# EAGLE design MEB-Quectel-BG96-v1.1.0 (EAGLE 9.3.1)

## Sheet 1 of 4
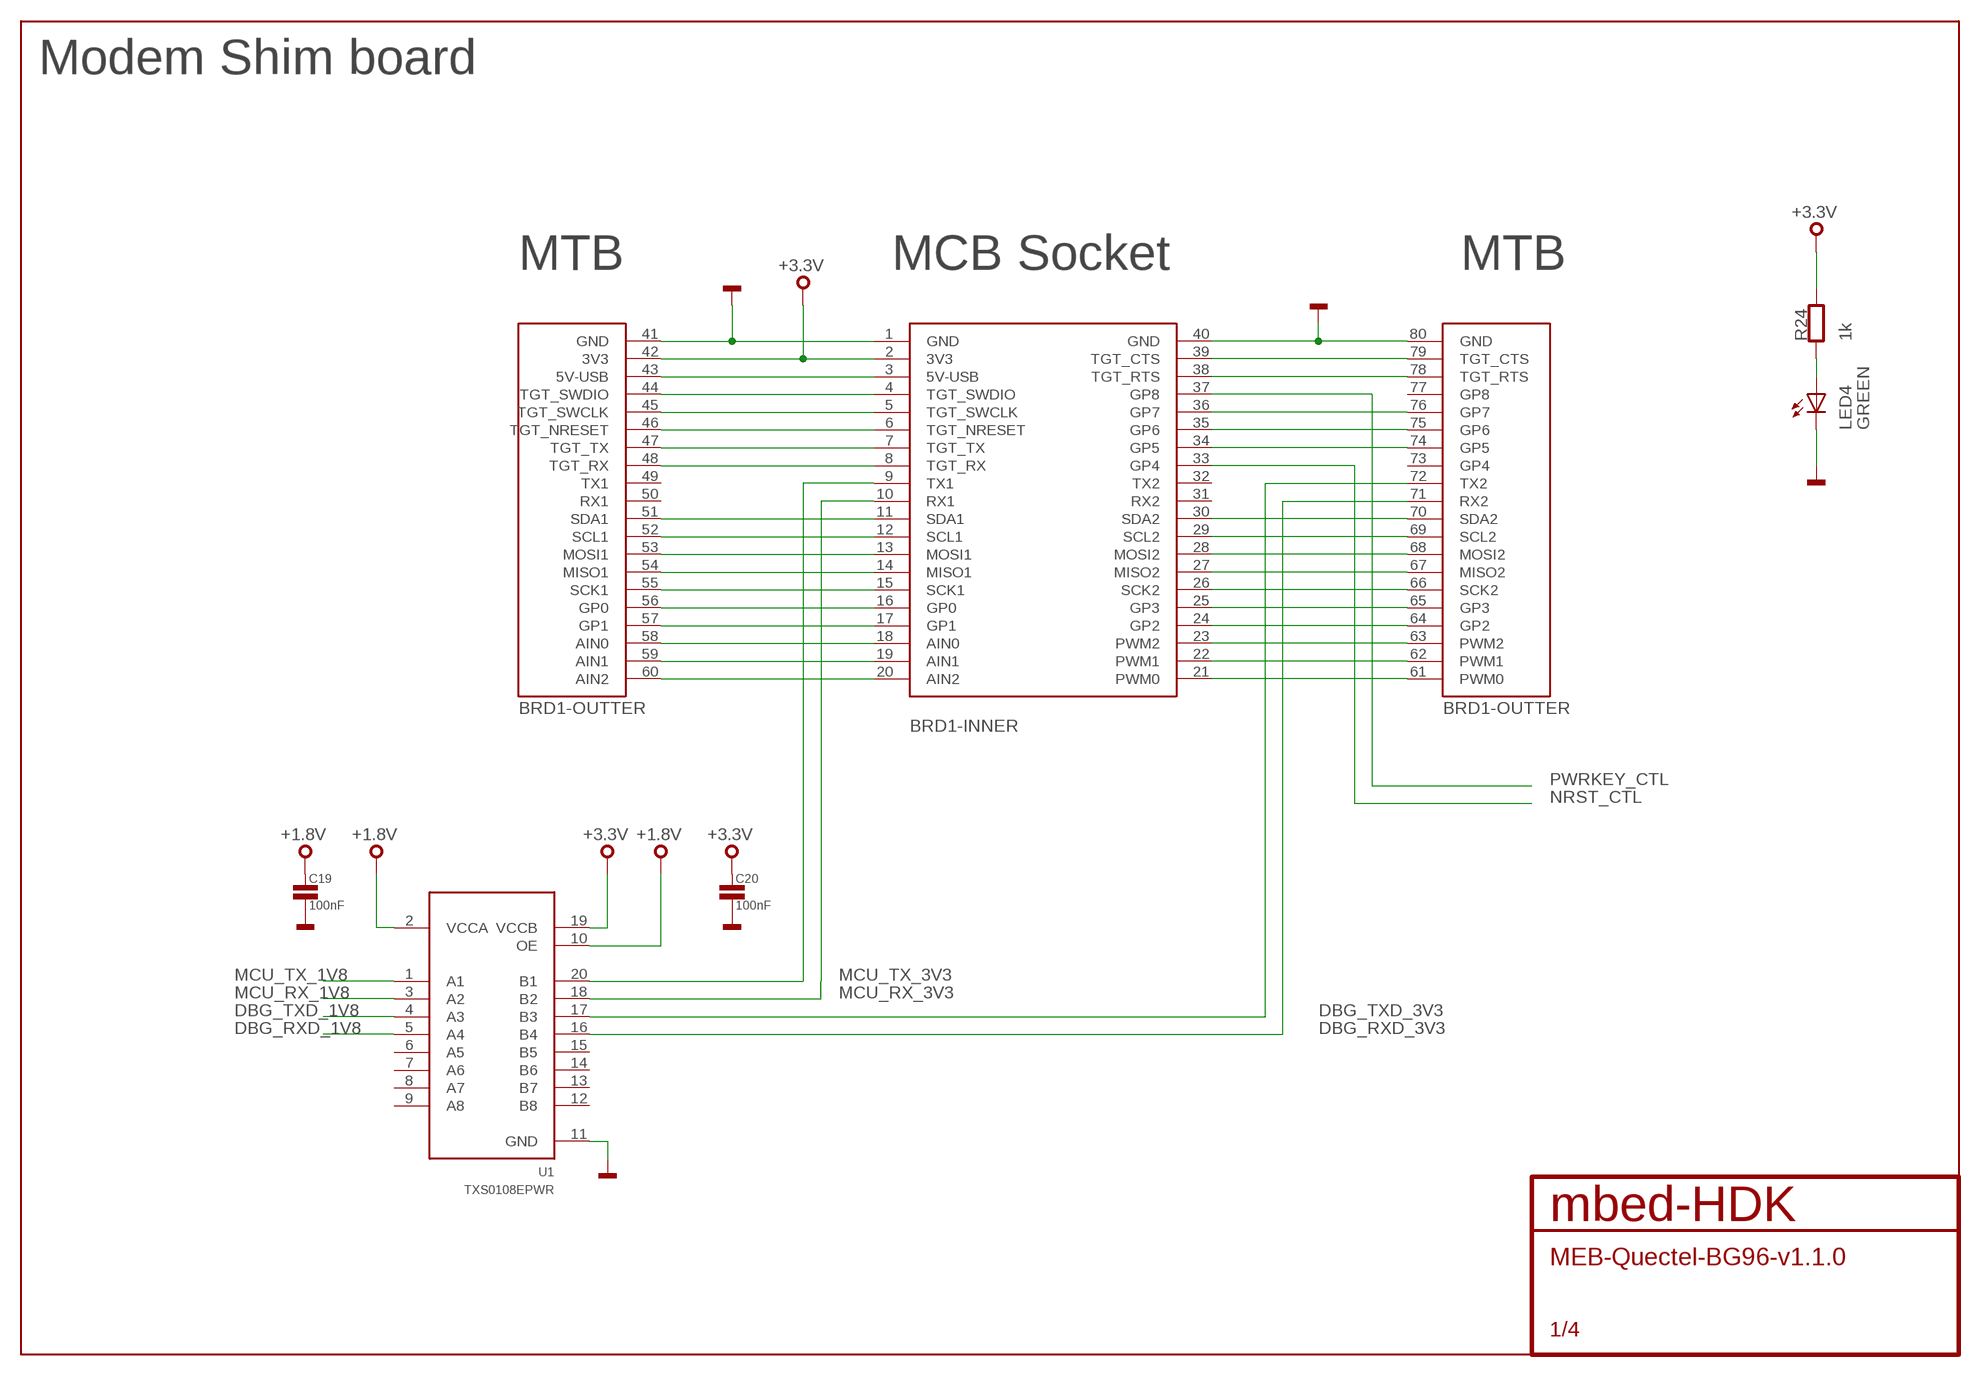
[diagram p0: schematic, sheet 1]

### Parts
BRD1  MODULE-SHIM  [MODULE_SOCKET]
C19  100nF  C0603  [0603]
C20  100nF  C0603  [0603]
LED4  GREEN  LED0603  [CHIPLED_0603]
R24  1k  R0603  [0603]
U1  TXS0108EPWR  [TSSOP-20]

### Nets
+1.8V: C19.1 U1.2(VCCA) U1.10(OE) ; also sheet 3
+3.3V: BRD1.2(-INNER:3V3) BRD1.42(-OUTTER:3V3) C20.1 R24.2 U1.19(VCCB)
DBG_RXD_1V8: U1.5(A4) ; also sheet 3
DBG_RXD_3V3: BRD1.71(-OUTTER:RX2) U1.16(B4)
DBG_TXD_1V8: U1.4(A3) ; also sheet 3
DBG_TXD_3V3: BRD1.72(-OUTTER:TX2) U1.17(B3)
GND: BRD1.1(-INNER:GND) BRD1.40(-INNER:GND) BRD1.41(-OUTTER:GND) BRD1.80(-OUTTER:GND) C19.2 C20.2 LED4.C U1.11(GND) ; also sheet 2,3,4
MCU_RX_1V8: U1.3(A2) ; also sheet 3
MCU_RX_3V3: BRD1.10(-INNER:RX1) U1.18(B2)
MCU_TX_1V8: U1.1(A1) ; also sheet 3
MCU_TX_3V3: BRD1.9(-INNER:TX1) U1.20(B1)
N$1: LED4.A R24.1
N$2: BRD1.39(-INNER:TGT_CTS) BRD1.79(-OUTTER:TGT_CTS)
N$3: BRD1.38(-INNER:TGT_RTS) BRD1.78(-OUTTER:TGT_RTS)
N$5: BRD1.36(-INNER:GP7) BRD1.76(-OUTTER:GP7)
N$6: BRD1.35(-INNER:GP6) BRD1.75(-OUTTER:GP6)
N$7: BRD1.34(-INNER:GP5) BRD1.74(-OUTTER:GP5)
N$11: BRD1.30(-INNER:SDA2) BRD1.70(-OUTTER:SDA2)
N$12: BRD1.29(-INNER:SCL2) BRD1.69(-OUTTER:SCL2)
N$13: BRD1.28(-INNER:MOSI2) BRD1.68(-OUTTER:MOSI2)
N$14: BRD1.27(-INNER:MISO2) BRD1.67(-OUTTER:MISO2)
N$15: BRD1.26(-INNER:SCK2) BRD1.66(-OUTTER:SCK2)
N$16: BRD1.25(-INNER:GP3) BRD1.65(-OUTTER:GP3)
N$17: BRD1.24(-INNER:GP2) BRD1.64(-OUTTER:GP2)
N$18: BRD1.23(-INNER:PWM2) BRD1.63(-OUTTER:PWM2)
N$19: BRD1.22(-INNER:PWM1) BRD1.62(-OUTTER:PWM1)
N$20: BRD1.21(-INNER:PWM0) BRD1.61(-OUTTER:PWM0)
N$23: BRD1.3(-INNER:5V-USB) BRD1.43(-OUTTER:5V-USB)
N$24: BRD1.4(-INNER:TGT_SWDIO) BRD1.44(-OUTTER:TGT_SWDIO)
N$25: BRD1.5(-INNER:TGT_SWCLK) BRD1.45(-OUTTER:TGT_SWCLK)
N$26: BRD1.6(-INNER:TGT_NRESET) BRD1.46(-OUTTER:TGT_NRESET)
N$27: BRD1.7(-INNER:TGT_TX) BRD1.47(-OUTTER:TGT_TX)
N$28: BRD1.8(-INNER:TGT_RX) BRD1.48(-OUTTER:TGT_RX)
N$31: BRD1.11(-INNER:SDA1) BRD1.51(-OUTTER:SDA1)
N$32: BRD1.12(-INNER:SCL1) BRD1.52(-OUTTER:SCL1)
N$33: BRD1.13(-INNER:MOSI1) BRD1.53(-OUTTER:MOSI1)
N$34: BRD1.14(-INNER:MISO1) BRD1.54(-OUTTER:MISO1)
N$35: BRD1.15(-INNER:SCK1) BRD1.55(-OUTTER:SCK1)
N$36: BRD1.16(-INNER:GP0) BRD1.56(-OUTTER:GP0)
N$37: BRD1.17(-INNER:GP1) BRD1.57(-OUTTER:GP1)
N$38: BRD1.18(-INNER:AIN0) BRD1.58(-OUTTER:AIN0)
N$39: BRD1.19(-INNER:AIN1) BRD1.59(-OUTTER:AIN1)
N$40: BRD1.20(-INNER:AIN2) BRD1.60(-OUTTER:AIN2)
NRST_CTL: BRD1.33(-INNER:GP4) ; also sheet 3
PWRKEY_CTL: BRD1.37(-INNER:GP8) ; also sheet 3
Unconnected: BRD1.31(-INNER:RX2) BRD1.32(-INNER:TX2) BRD1.49(-OUTTER:TX1) BRD1.50(-OUTTER:RX1) BRD1.73(-OUTTER:GP4) BRD1.77(-OUTTER:GP8) U1.6(A5) U1.7(A6) U1.8(A7) U1.9(A8) U1.12(B8) U1.13(B7) U1.14(B6) U1.15(B5)

### Notes on the sheet
- Modem Shim board
- MTB | MCB Socket | MTB

## Sheet 2 of 4
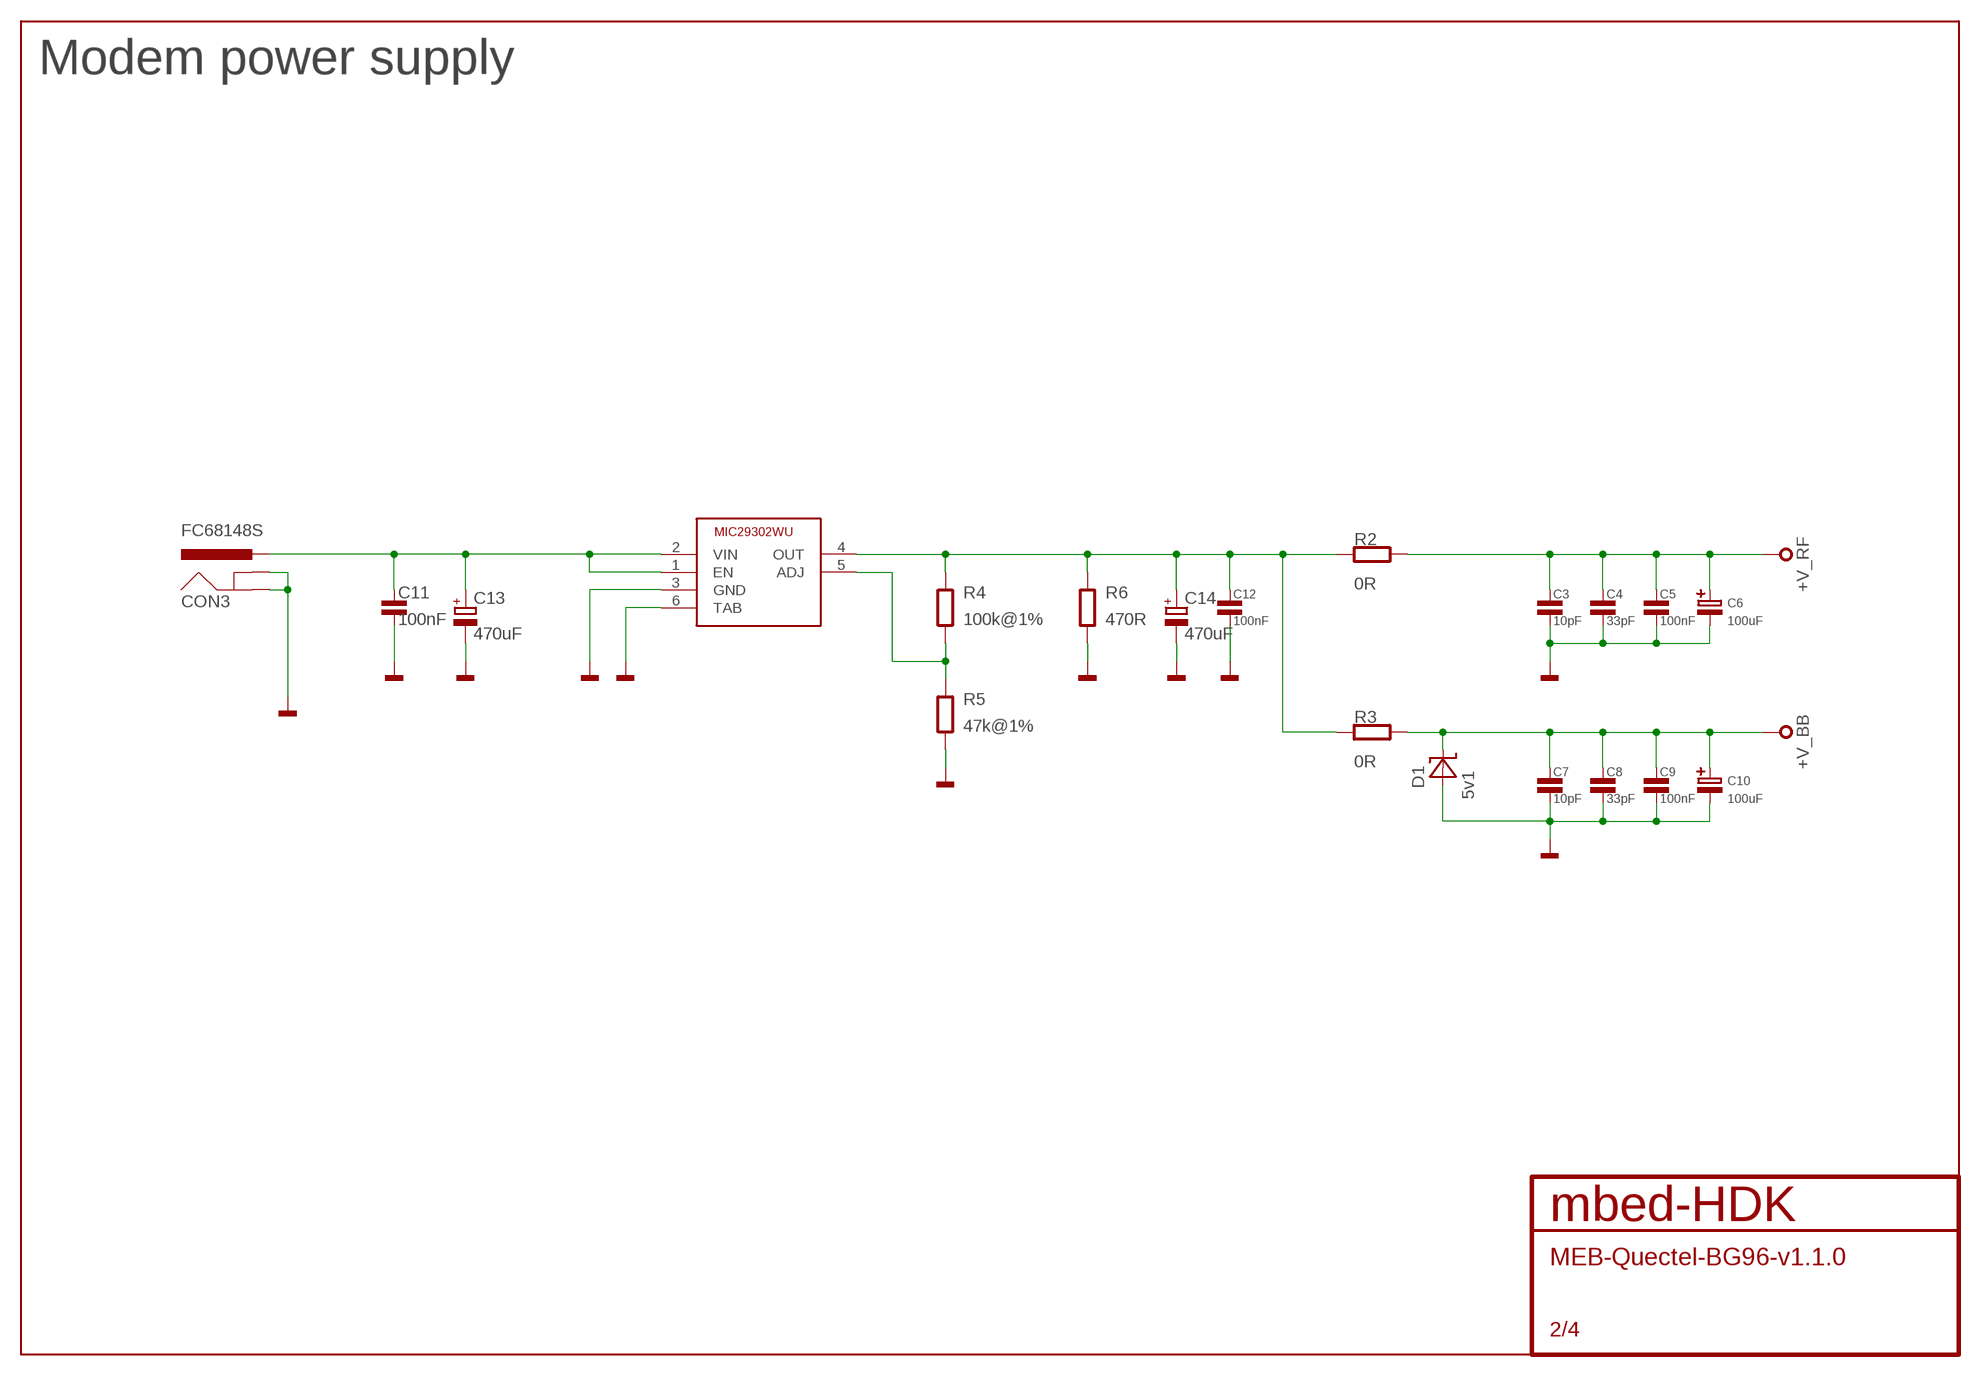
[diagram p1: schematic, sheet 2]

### Parts
C3  10pF  C0603  [0603]
C4  33pF  C0603  [0603]
C5  100nF  C0603  [0603]
C6  100uF  C-POLA  [SMC_A]
C7  10pF  C0603  [0603]
C8  33pF  C0603  [0603]
C9  100nF  C0603  [0603]
C10  100uF  C-POLA  [SMC_A]
C11  100nF  C0603  [0603]
C12  100nF  C0603  [0603]
C13  470uF  CPOL-EU150CLZ-0810  [150CLZ-0810]
C14  470uF  CPOL-EU150CLZ-0810  [150CLZ-0810]
CON3  FC68148S  [FC68148S]
D1  5v1  DIODE-ZENER  [SOD123]
IC1  MIC29302WU  [TO263-5]
R2  0R  R0603  [0603]
R3  0R  R0603  [0603]
R4  100k@1%  R0603  [0603]
R5  47k@1%  R0603  [0603]
R6  470R  R0603  [0603]

### Nets
+V_BB: C7.1 C8.1 C9.1 C10.+ D1.2(C) R3.2 ; also sheet 3
+V_RF: C3.1 C4.1 C5.1 C6.+ R2.2 ; also sheet 3
GND: C3.2 C4.2 C5.2 C6.- C7.2 C8.2 C9.2 C10.- C11.2 C12.2 C13.- C14.- CON3.2(GNDBREAK) CON3.3(GND) D1.1(A) IC1.3(GND) IC1.6(TAB) R5.1 R6.1 ; also sheet 1,3,4
N$41: C11.1 C13.+ CON3.1-1(PWR) CON3.1-2(PWR) IC1.1(EN) IC1.2(VIN)
N$42: IC1.5(ADJ) R4.1 R5.2
N$71: C12.1 C14.+ IC1.4(OUT) R2.1 R3.1 R4.2 R6.2

### Notes on the sheet
- Modem power supply

## Sheet 3 of 4
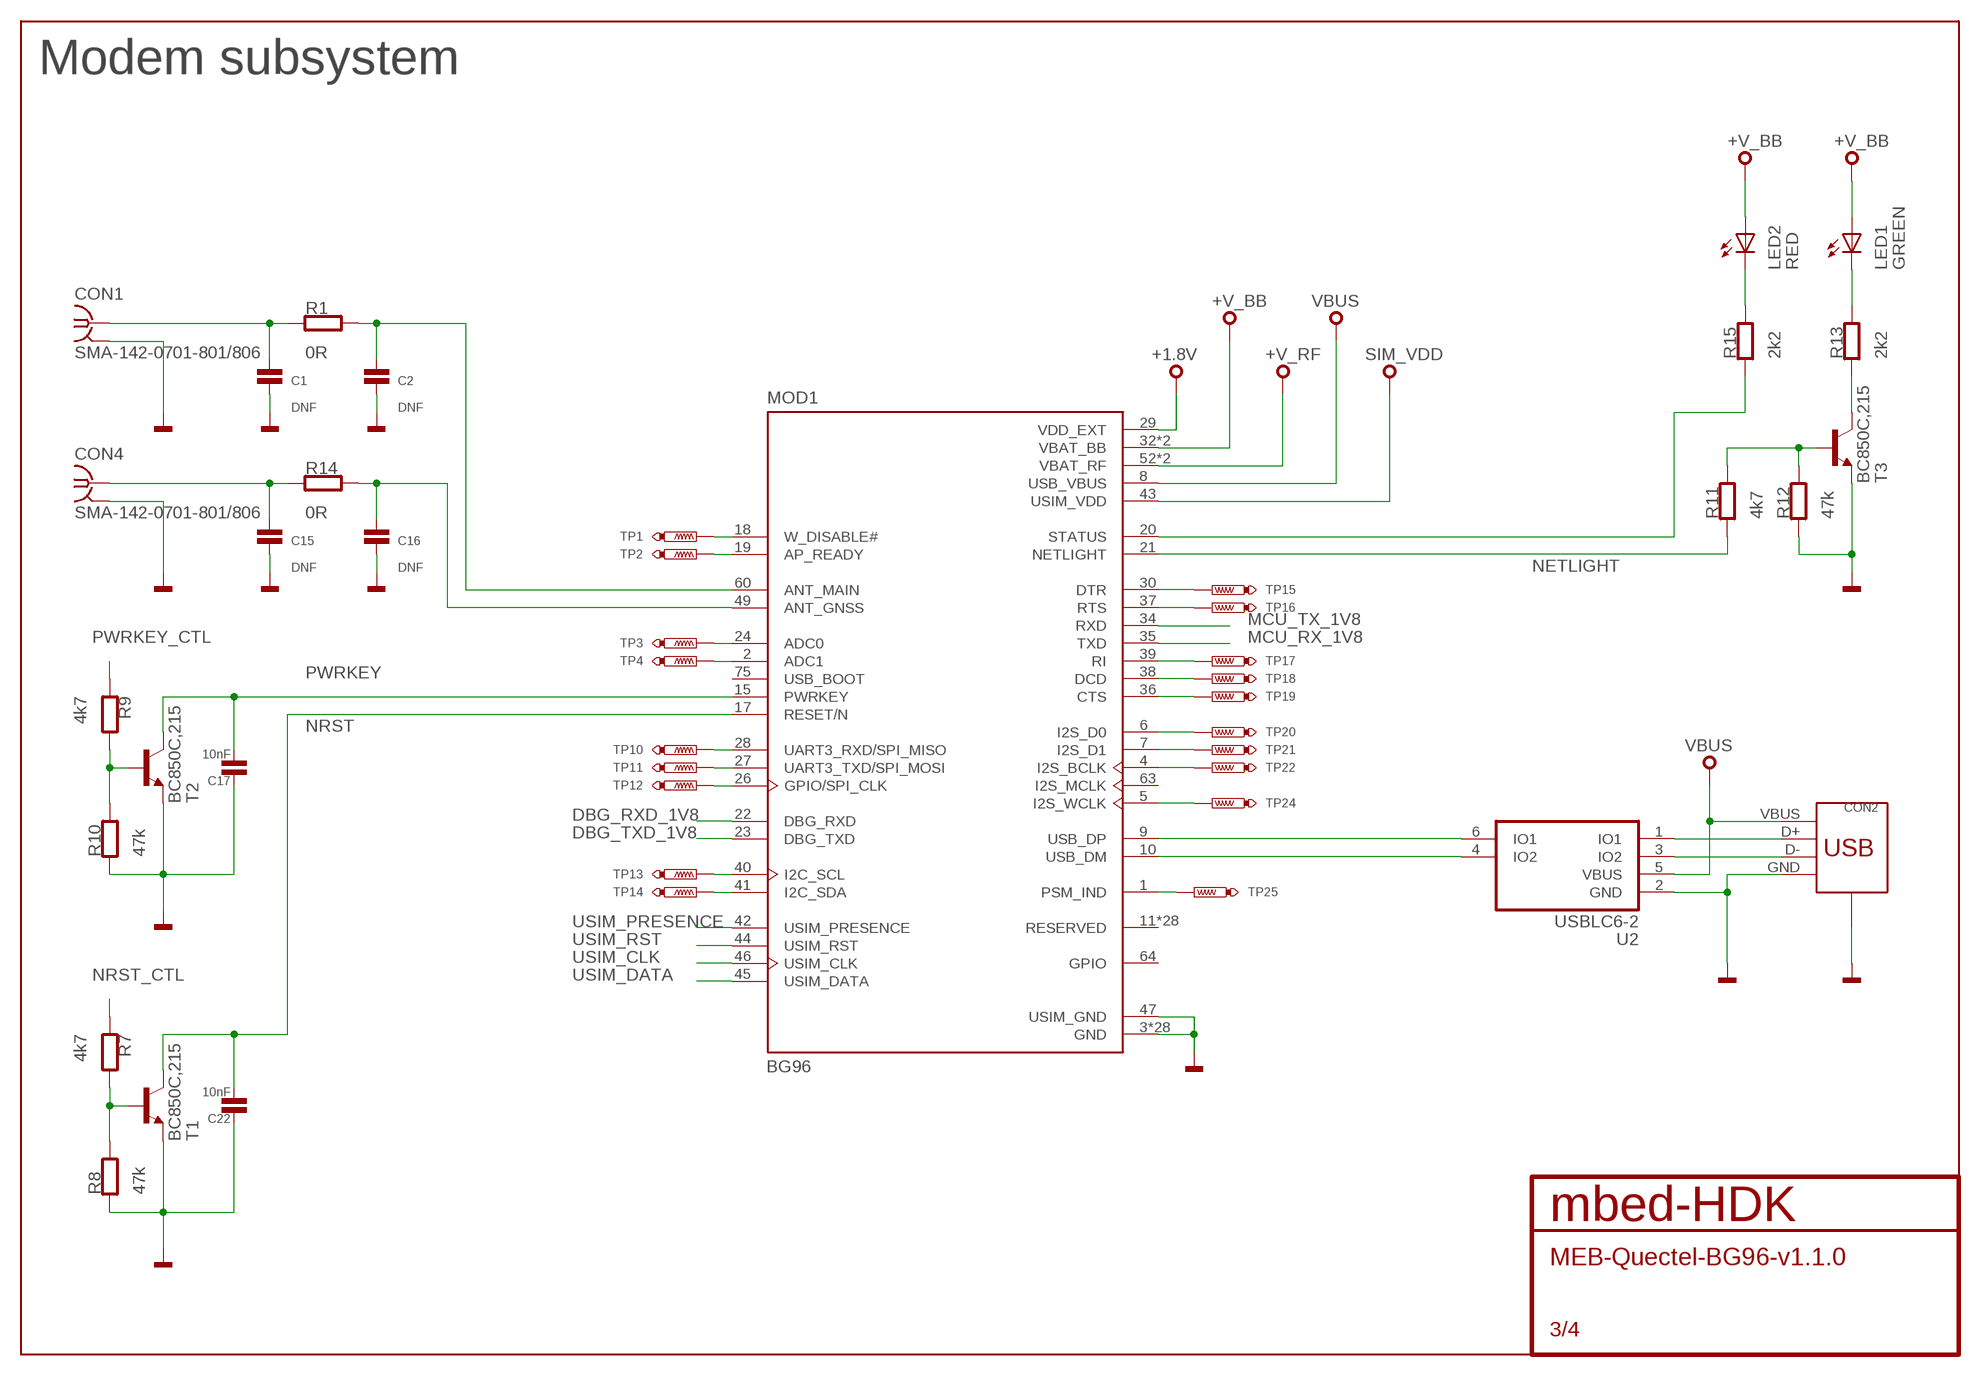
[diagram p2: schematic, sheet 3]

### Parts
C1  DNF  C0603  [0603]
C2  DNF  C0603  [0603]
C15  DNF  C0603  [0603]
C16  DNF  C0603  [0603]
C17  10nF  C0603  [0603]
C22  10nF  C0603  [0603]
CON1  SMA-142-0701-801/806  [J502-ND-142-0701-801/806]
CON2  47346-0001  [USB-MICRO-B-H]
CON4  SMA-142-0701-801/806  [J502-ND-142-0701-801/806]
LED1  GREEN  LED0603  [CHIPLED_0603]
LED2  RED  LED0603  [CHIPLED_0603]
MOD1  BG96  [LTE_MODULE_BG96]
R1  0R  R0603  [0603]
R7  4k7  R0603  [0603]
R8  47k  R0603  [0603]
R9  4k7  R0603  [0603]
R10  47k  R0603  [0603]
R11  4k7  R0603  [0603]
R12  47k  R0603  [0603]
R13  2k2  R0603  [0603]
R14  0R  R0603  [0603]
R15  2k2  R0603  [0603]
T1  BC850C,215  [SOT23-3]
T2  BC850C,215  [SOT23-3]
T3  BC850C,215  [SOT23-3]
TP1  TEST_POINT-50R-SMD  [TP50-SMD]
TP2  TEST_POINT-50R-SMD  [TP50-SMD]
TP3  TEST_POINT-50R-SMD  [TP50-SMD]
TP4  TEST_POINT-50R-SMD  [TP50-SMD]
TP10  TEST_POINT-50R-SMD  [TP50-SMD]
TP11  TEST_POINT-50R-SMD  [TP50-SMD]
TP12  TEST_POINT-50R-SMD  [TP50-SMD]
TP13  TEST_POINT-50R-SMD  [TP50-SMD]
TP14  TEST_POINT-50R-SMD  [TP50-SMD]
TP15  TEST_POINT-50R-SMD  [TP50-SMD]
TP16  TEST_POINT-50R-SMD  [TP50-SMD]
TP17  TEST_POINT-50R-SMD  [TP50-SMD]
TP18  TEST_POINT-50R-SMD  [TP50-SMD]
TP19  TEST_POINT-50R-SMD  [TP50-SMD]
TP20  TEST_POINT-50R-SMD  [TP50-SMD]
TP21  TEST_POINT-50R-SMD  [TP50-SMD]
TP22  TEST_POINT-50R-SMD  [TP50-SMD]
TP24  TEST_POINT-50R-SMD  [TP50-SMD]
TP25  TEST_POINT-50R-SMD  [TP50-SMD]
U2  USBLC6-2SC6  [SOT23-6L]

### Nets
+1.8V: MOD1.29(VDD_EXT) ; also sheet 1
+V_BB: LED1.A LED2.A MOD1.32(VBAT_BB) MOD1.33(VBAT_BB) ; also sheet 2
+V_RF: MOD1.52(VBAT_RF) MOD1.53(VBAT_RF) ; also sheet 2
DBG_RXD_1V8: MOD1.22(DBG_RXD) ; also sheet 1
DBG_TXD_1V8: MOD1.23(DBG_TXD) ; also sheet 1
GND: C1.1 C2.1 C15.1 C16.1 C17.1 C22.1 CON1.G@1 CON1.G@2 CON1.G@3 CON1.G@4 CON2.GND CON2.GND1(SHEILD) CON2.GND2(SHEILD) CON2.GND3(SHEILD) CON2.GND4(SHEILD) CON4.G@1 CON4.G@2 CON4.G@3 CON4.G@4 MOD1.3(GND) MOD1.31(GND) MOD1.47(USIM_GND) MOD1.48(GND) MOD1.50(GND) MOD1.54(GND) MOD1.55(GND) MOD1.58(GND) MOD1.59(GND) MOD1.61(GND) MOD1.62(GND) MOD1.67(GND) MOD1.68(GND) MOD1.69(GND) MOD1.70(GND) MOD1.71(GND) MOD1.72(GND) MOD1.73(GND) MOD1.74(GND) MOD1.79(GND) MOD1.80(GND) MOD1.81(GND) MOD1.82(GND) MOD1.89(GND) MOD1.90(GND) MOD1.91(GND) MOD1.100(GND) MOD1.101(GND) MOD1.102(GND) R8.1 R10.1 R12.1 T1.2(E) T2.2(E) T3.2(E) U2.2(GND) ; also sheet 1,2,4
MCU_RX_1V8: MOD1.35(TXD) ; also sheet 1
MCU_TX_1V8: MOD1.34(RXD) ; also sheet 1
N$4: LED2.C R15.2
N$8: LED1.C R13.2
N$9: MOD1.30(DTR) TP15.TP
N$10: MOD1.37(RTS) TP16.TP
N$21: MOD1.39(RI) TP17.TP
N$22: MOD1.38(DCD) TP18.TP
N$29: C1.2 CON1.1 R1.1
N$30: C2.2 MOD1.60(ANT_MAIN) R1.2
N$43: C15.2 CON4.1 R14.1
N$45: C16.2 MOD1.49(ANT_GNSS) R14.2
N$46: R9.2 R10.2 T2.1(B)
N$48: MOD1.36(CTS) TP19.TP
N$49: R7.2 R8.2 T1.1(B)
N$50: MOD1.6(I2S_D0) TP20.TP
N$51: CON2.D+ U2.1(IO1)
N$52: MOD1.7(I2S_D1) TP21.TP
N$53: MOD1.4(I2S_BCLK) TP22.TP
N$54: CON2.D- U2.3(IO2)
N$56: MOD1.9(USB_DP) U2.6(IO1)
N$57: MOD1.10(USB_DM) U2.4(IO2)
N$58: R11.2 R12.2 T3.1(B)
N$59: MOD1.5(I2S_WCLK) TP24.TP
N$61: MOD1.1(PSM_IND) TP25.TP
N$63: MOD1.41(I2C_SDA) TP14.TP
N$64: MOD1.40(I2C_SCL) TP13.TP
N$65: MOD1.26(GPIO/SPI_CLK) TP12.TP
N$68: MOD1.27(UART3_TXD/SPI_MOSI) TP11.TP
N$69: MOD1.28(UART3_RXD/SPI_MISO) TP10.TP
N$70: MOD1.18(W_DISABLE#) TP1.TP
N$72: MOD1.19(AP_READY) TP2.TP
N$74: MOD1.2(ADC1) TP4.TP
N$75: MOD1.24(ADC0) TP3.TP
NETLIGHT: MOD1.21(NETLIGHT) R11.1
NRST: C22.2 MOD1.17(RESET/N) T1.3(C)
NRST1: R13.1 T3.3(C)
NRST_CTL: R7.1 ; also sheet 1
PWRKEY: C17.2 MOD1.15(PWRKEY) T2.3(C)
PWRKEY_CTL: R9.1 ; also sheet 1
SIM_VDD: MOD1.43(USIM_VDD) ; also sheet 4
STATUS: MOD1.20(STATUS) R15.1
USIM_CLK: MOD1.46(USIM_CLK) ; also sheet 4
USIM_DATA: MOD1.45(USIM_DATA) ; also sheet 4
USIM_PRESENCE: MOD1.42(USIM_PRESENCE) ; also sheet 4
USIM_RST: MOD1.44(USIM_RST) ; also sheet 4
VBUS: CON2.VBUS MOD1.8(USB_VBUS) U2.5(VBUS)
Unconnected: MOD1.11(RESERVED) MOD1.12(RESERVED) MOD1.13(RESERVED) MOD1.14(RESERVED) MOD1.16(RESERVED) MOD1.25(RESERVED) MOD1.51(RESERVED) MOD1.56(RESERVED) MOD1.57(RESERVED) MOD1.63(I2S_MCLK) MOD1.64(GPIO) MOD1.65(RESERVED) MOD1.66(RESERVED) MOD1.75(USB_BOOT) MOD1.76(RESERVED) MOD1.77(RESERVED) MOD1.78(RESERVED) MOD1.83(RESERVED) MOD1.84(RESERVED) MOD1.85(RESERVED) MOD1.86(RESERVED) MOD1.87(RESERVED) MOD1.88(RESERVED) MOD1.92(RESERVED) MOD1.93(RESERVED) MOD1.94(RESERVED) MOD1.95(RESERVED) MOD1.96(RESERVED) MOD1.97(RESERVED) MOD1.98(RESERVED) MOD1.99(RESERVED)

### Notes on the sheet
- Modem subsystem

## Sheet 4 of 4
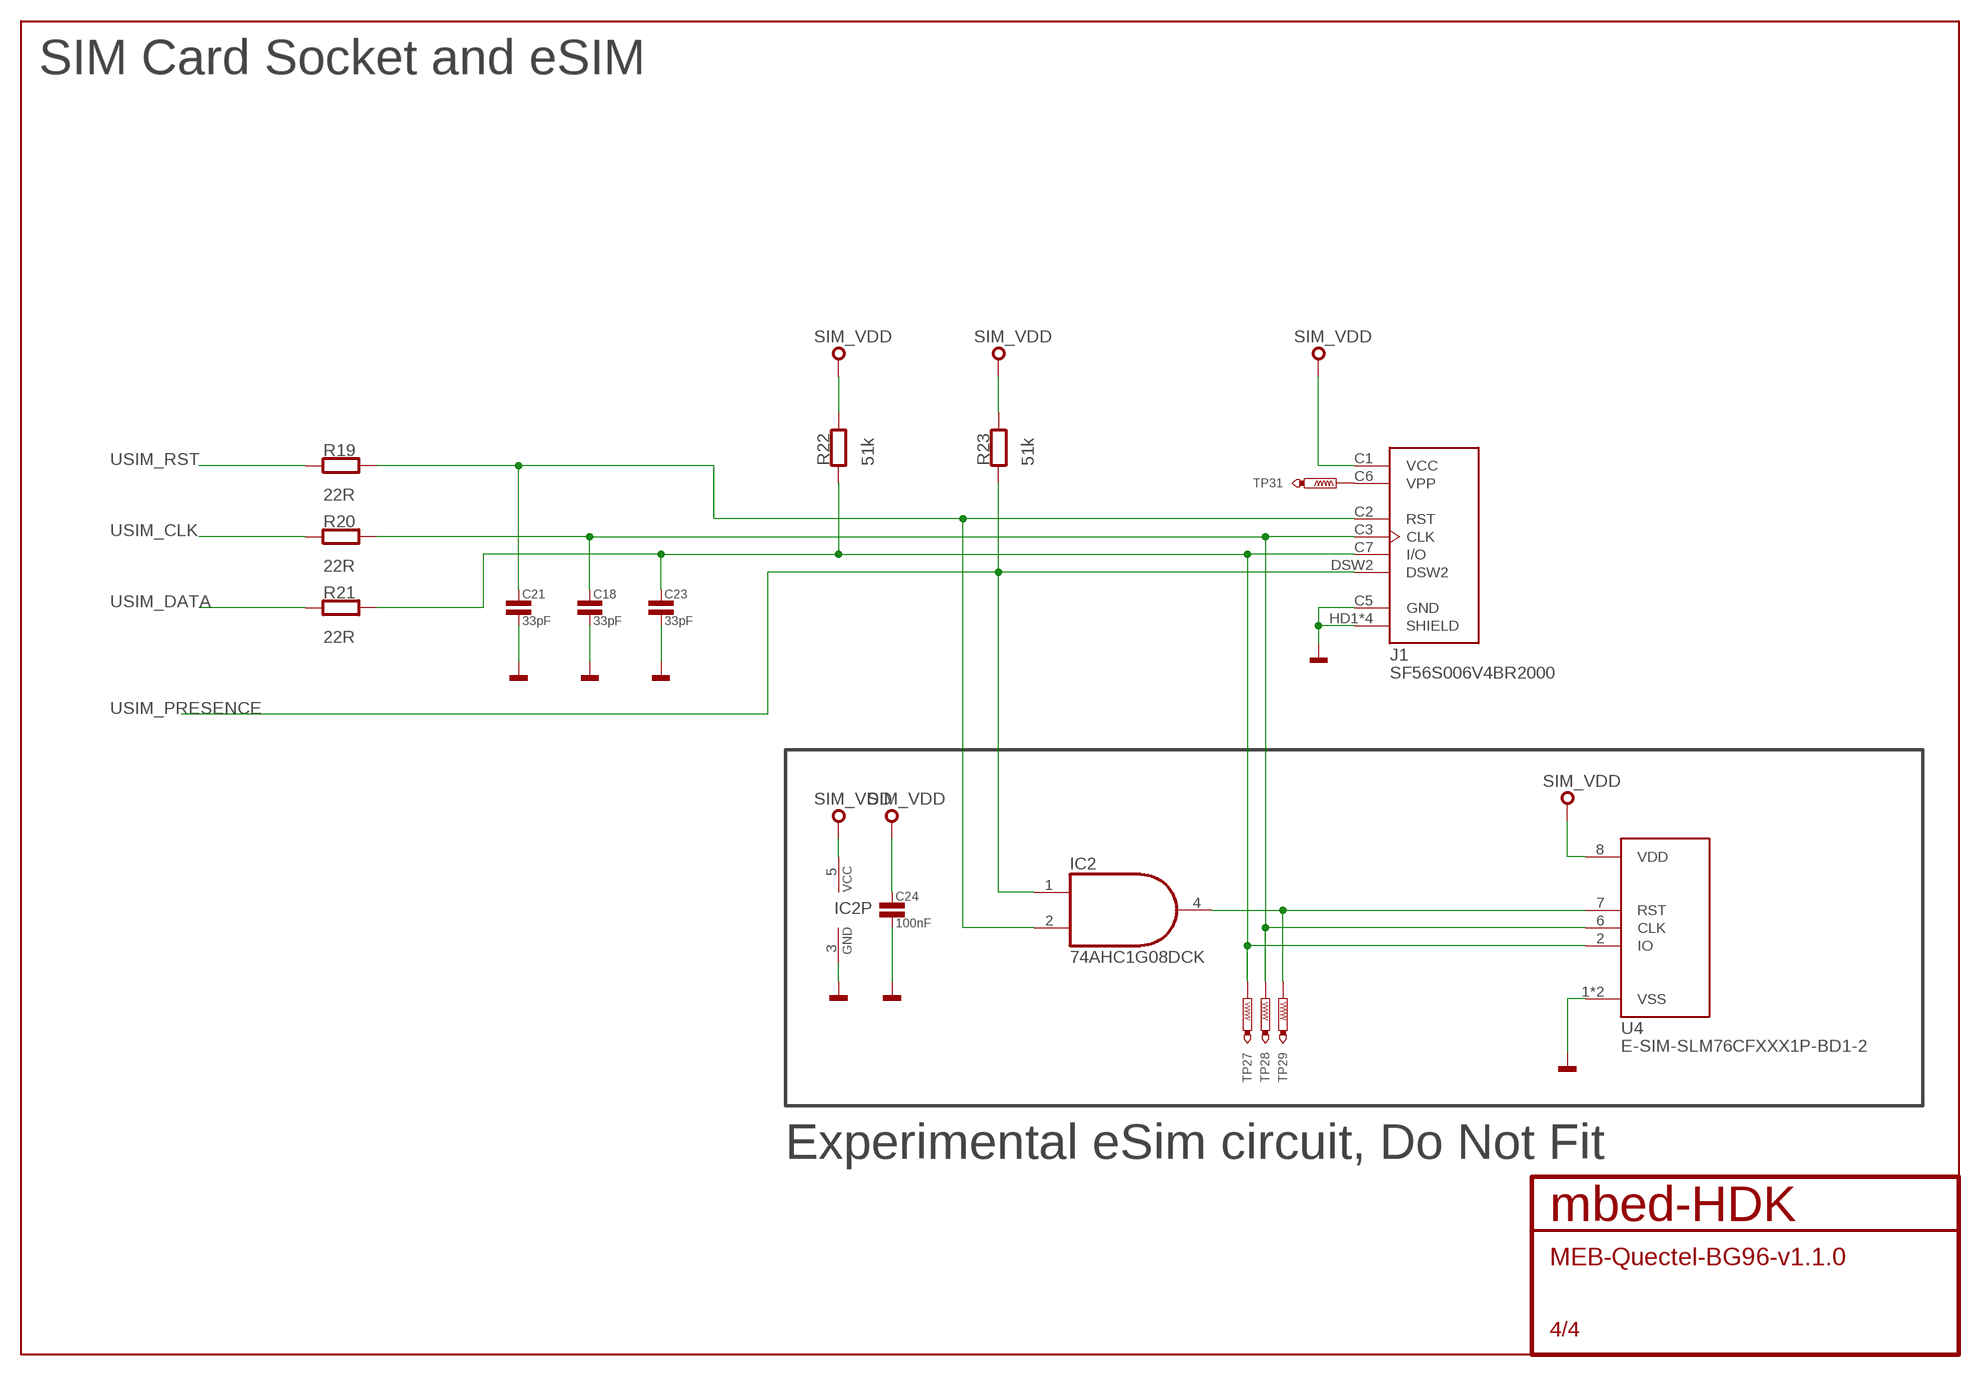
[diagram p3: schematic, sheet 4]

### Parts
C18  33pF  C0603  [0603]
C21  33pF  C0603  [0603]
C23  33pF  C0603  [0603]
C24  100nF  C0603  [0603]
IC2  74AHC1G08DCK  [SC70-5]
J1  SF56S006V4BR2000  [JAE_SF56S006V4BR2000]
R19  22R  R0603  [0603]
R20  22R  R0603  [0603]
R21  22R  R0603  [0603]
R22  51k  R0603  [0603]
R23  51k  R0603  [0603]
TP27  TEST_POINT-50R-SMD  [TP50-SMD]
TP28  TEST_POINT-50R-SMD  [TP50-SMD]
TP29  TEST_POINT-50R-SMD  [TP50-SMD]
TP31  TEST_POINT-50R-SMD  [TP50-SMD]
U4  E-SIM-SLM76CFXXX1P-BD1-2  [VQFN-8-1]

### Nets
GND: C18.2 C21.2 C23.2 C24.2 IC2.3(GND) J1.C5(GND) J1.HD1(SHIELD) J1.HD2,DSW1(SHIELD) J1.HD3(SHIELD) J1.HD4(SHIELD) U4.1(VSS) U4.P(VSS) ; also sheet 1,2,3
N$47: IC2.4(O) TP29.TP U4.7(RST)
N$60: C21.1 IC2.2(I1) J1.C2(RST) R19.2
N$66: C18.1 J1.C3(CLK) R20.2 TP28.TP U4.6(CLK)
N$67: C23.1 J1.C7(I/O) R21.2 R22.1 TP27.TP U4.2(IO)
N$89: J1.C6(VPP) TP31.TP
SIM_VDD: C24.1 IC2.5(VCC) J1.C1(VCC) R22.2 R23.2 U4.8(VDD) ; also sheet 3
USIM_CLK: R20.1 ; also sheet 3
USIM_DATA: R21.1 ; also sheet 3
USIM_PRESENCE: IC2.1(I0) J1.DSW2 R23.1 ; also sheet 3
USIM_RST: R19.1 ; also sheet 3

### Notes on the sheet
- SIM Card Socket and eSIM
- Experimental eSim circuit, Do Not Fit

## Library data of the parts
BRD1 = mbed-HDK-misc-Board:MODULE-SHIM
C1-C5 C7-C9 C11 C12 C15-C24 = mbed-HDK-RLC:C: Capacitor
C6 C10 = mbed-HDK-RLC:C-POL: Polarised capacitor
C13 C14 = rcl:CPOL-EU: POLARIZED CAPACITOR, European symbol
CON1 CON4 = mbed-HDK-Connector:SMA-: SMA 50 Ohm End Launch Jack Receptacle - Round Contact Johnson Components Source: www.johnsoncomponents.com .. J502-ND.pdf; MF: JOHNSON COMPONENTS; MPN: 142-0701-801; OC_FARNELL: 1608592; OC_NEWARK: 90F2624
CON2 = mbed-HDK-Connector:47346-0001: USB Receptacle Horizontal Micro Type B; MF: MOLEX; MFN: 47346-0001; OC-DIGIKEY: WM17141CT-ND; OC-MOUSER: 538-47346-0001; OC-NEWARK: 1568026
CON3 = mbed-HDK-Connector:FC68148S: Power Jack This is the standard 5.5mm barrel jack for power. The PTH is the most common, proven, reliable, footprint. The Slot footprint only works if the mill layer is transmitted to the PCB fab house so be warned. Mating wall wart : TOL-00298 (and others); MF: Cliff; MFN: FC68148S; OC_NEWARK: 1889309
D1 = mbed-HDK-Discrete:DIODE-ZENER
IC1 = SnapEDA:MIC29302WU; AVAILABILITY: Unavailable; DESCRIPTION: MIC29302 Series 3 A 1.24 to 26 V ADJ Output Voltage LDO Regulator - TO-263-5; MF: Microchip; MP: MIC29302WU; PACKAGE: TO-263-5 Microchip; PRICE: None
IC2 = 74xx-little-us:74*1G08: 2-input AND gate
J1 = SnapEDA:SF56S006V4BR2000: CONN MICRO SIM CARD PUSH-PUSH; DESCRIPTION: SF56 series, micro-SIM card connector, push-push type, normal closed; DIGI-KEY_PART_NUMBER: 670-2834-1-ND; DIGI-KEY_PURCHASE_URL: https://www.digikey.co.uk/product-detail/en/jae-electronics/SF56S006V4BR2000/670-2834-1-ND/5280152?utm_source=snapeda&utm_medium=aggregator&utm_campaign=symbol; MF: JAE Electronics; MP: SF56S006V4BR2000; PACKAGE: None
LED1 LED2 LED4 = mbed-HDK-Optical:LED: LED SMD
MOD1 = SnapEDA:BG96: Lte Cat.M1 Module For Global Sku; AVAILABILITY: Unavailable; DESCRIPTION: Lte Cat.M1 Module For Global Sku; MF: Quectel; MP: BG96; PACKAGE: None; PRICE: 124.49 USD
R1-R15 R19-R24 = mbed-HDK-RLC:R: Resistor
T1-T3 = mbed-HDK-Discrete:BC850C,215: BJT NPN; DIGIKEY-OC: 568-6077-1-ND; MF: NXP Semiconductors; MFN: BC850C,215; MOUSER-OC: 771-BC850C-T/R; NEWARK-OC: 75R0745
TP1-TP4 TP10-TP22 TP24 TP25 TP27-TP29 TP31 = mbed-HDK-Test:TEST_POINT
U1 = mbed-HDK-IC:TXS0108EPWR: 8-Bit Bi-directional, Level-Shifting, Voltage Translator; MF: Texas Instruments; MFN: TXS0108EPWR; OC-DIGIKEY: 296-23011-1-ND; OC-MOUSER: 595-TXS0108EPWR; OC-NEWARK: 05R8300
U2 = mbed-HDK-IC:USBLC6-2: 2 line Transient voltage suppressor; MF: STMicro; MFN: USBLC6-2SC6Y; OC-DIGIKEY: 497-11882-1-ND; OC-MOUSER: 511-USBLC6-2SC6Y; OC-NEWARK: 2629711
U4 = mbed-HDK-IC:E-SIM

## Board
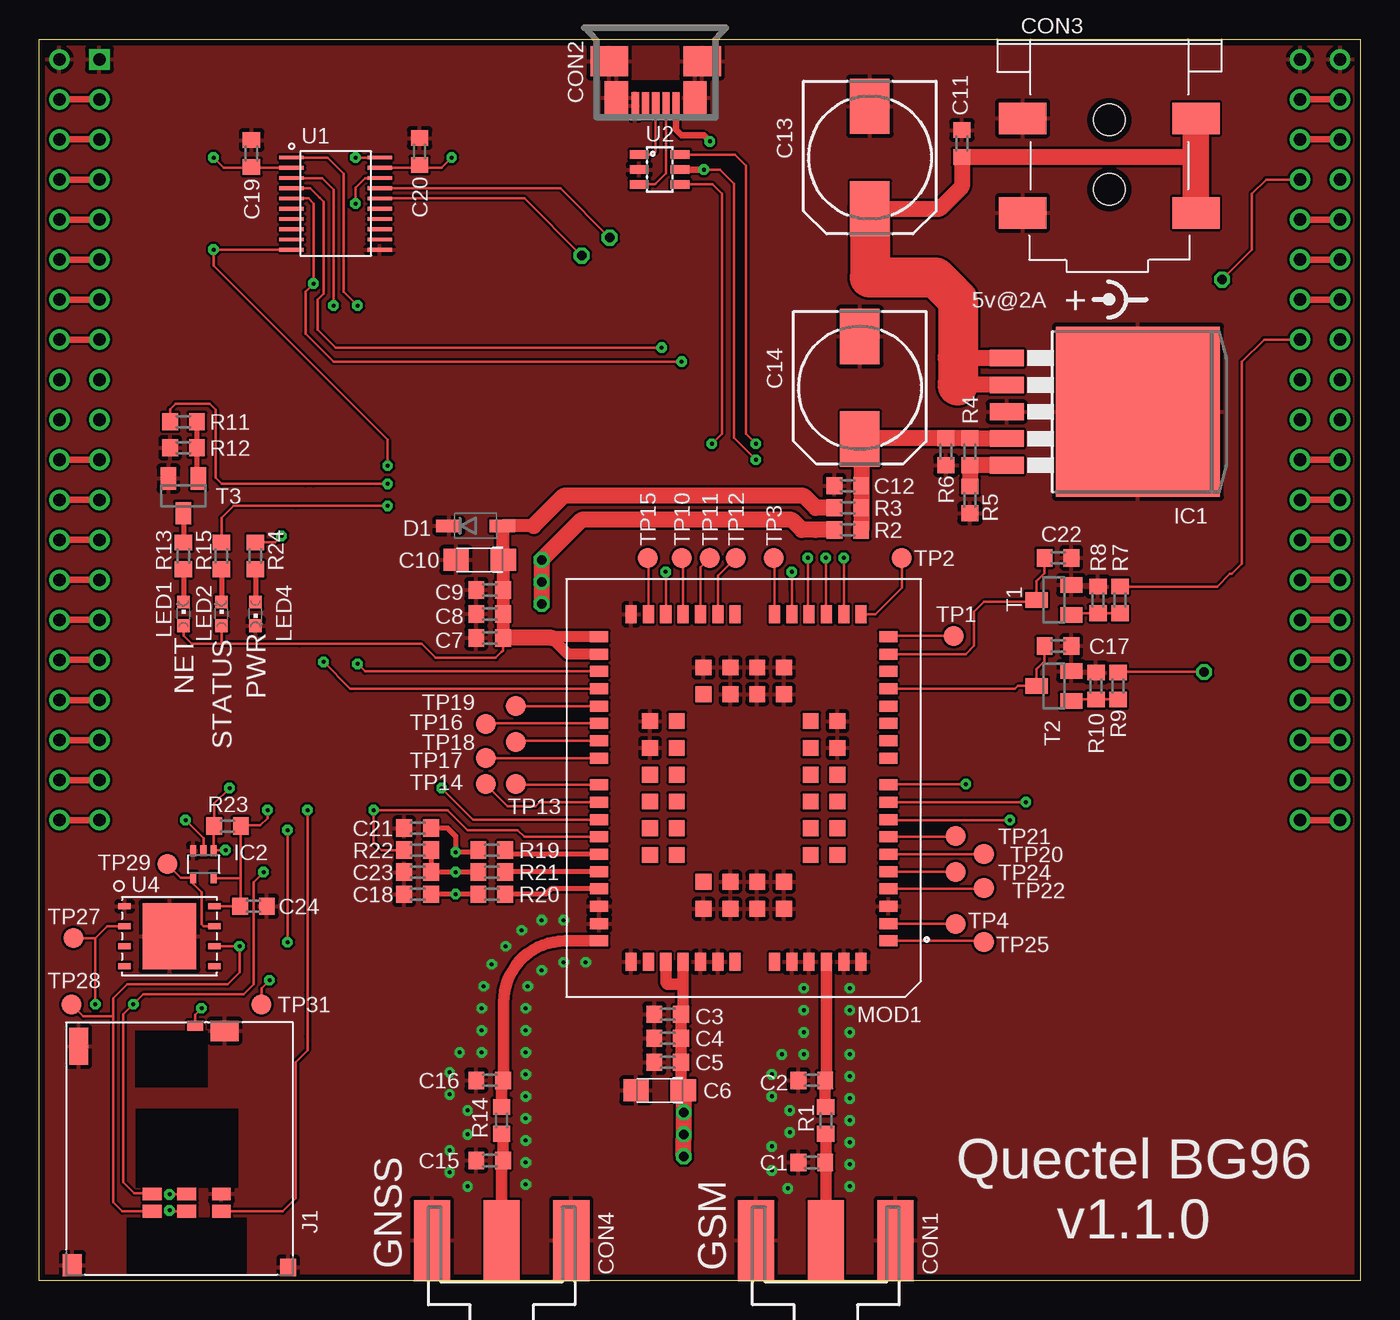
[diagram p4: board, top side]
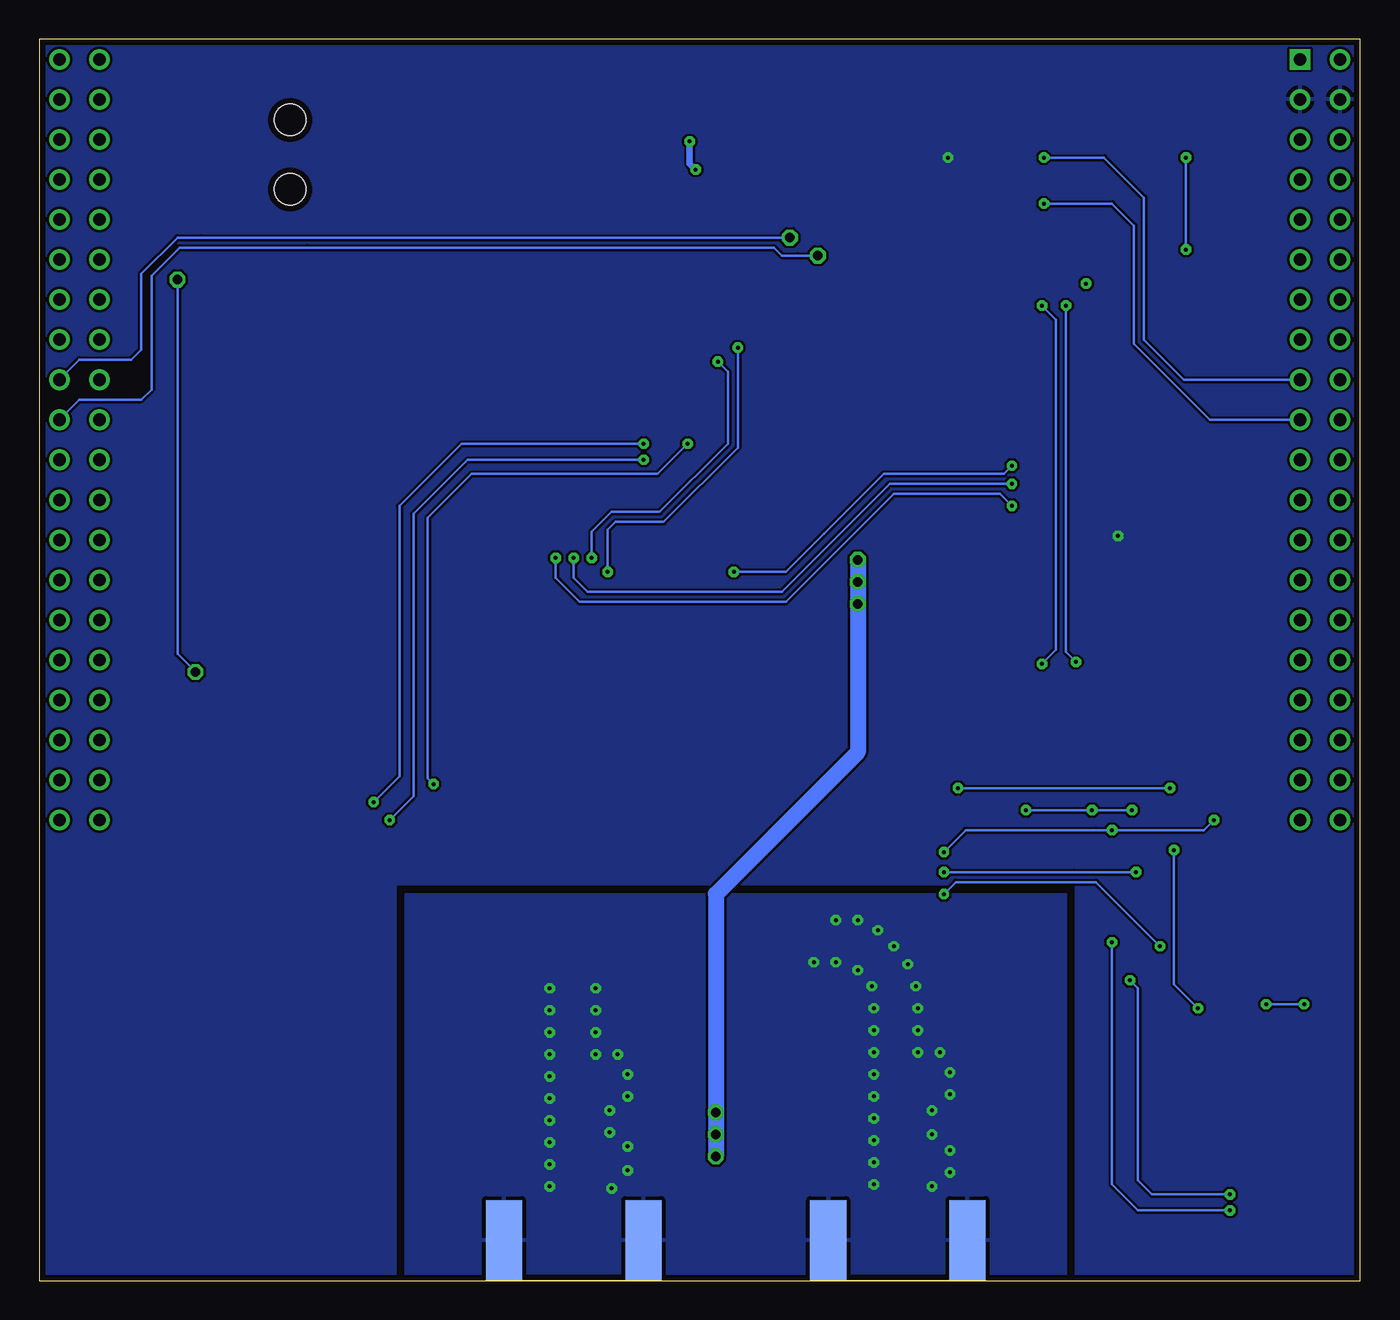
[diagram p5: board, bottom side, seen from below]

Size 83.82 x 78.74 mm. Coordinates in mm from the lower left corner, seen from the top.
Outline: 0,78.74 83.82,78.74 83.82,0 0,0 0,78.74
Copper layers ((1*16)): Top 0.035mm / dielectric 0.8mm / Bottom 0.035mm
Design rules "mbed-HDK-6-6-2-layer": minimum track width 6mil, minimum drill 9mil, track to track 6mil, track to pad 6mil, pad to pad 6mil, via to via 6mil, smd to smd 6mil, copper to edge 15mil, drill to drill 8mil, minimum pad ring 10mil, minimum via ring 8mil, stop-mask expansion 4mil, vias tented up to drill 0mil, thermal gap 10mil

### Footprints (pad centres in the part's own frame; a part is rotated, then mirrored left to right if it is on the bottom)
MODULE_SOCKET = drill 0.8 square: 1 0,0 | drill 0.8: 2 0,-2.54; 3 0,-5.08; 4 0,-7.62; 5 0,-10.16; 6 0,-12.7; 7 0,-15.24; 8 0,-17.78; 9 0,-20.32; 10 0,-22.86; 11 0,-25.4; 12 0,-27.94; 13 0,-30.48; 14 0,-33.02; 15 0,-35.56; 16 0,-38.1; 17 0,-40.64; 18 0,-43.18; 19 0,-45.72; 20 0,-48.26; 21 76.2,-48.26; 22 76.2,-45.72; 23 76.2,-43.18; 24 76.2,-40.64; 25 76.2,-38.1; 26 76.2,-35.56; 27 76.2,-33.02; 28 76.2,-30.48; 29 76.2,-27.94; 30 76.2,-25.4; 31 76.2,-22.86; 32 76.2,-20.32; 33 76.2,-17.78; 34 76.2,-15.24; 35 76.2,-12.7; 36 76.2,-10.16; 37 76.2,-7.62; 38 76.2,-5.08; 39 76.2,-2.54; 40 76.2,0; 41 -2.54,0; 42 -2.54,-2.54; 43 -2.54,-5.08; 44 -2.54,-7.62; 45 -2.54,-10.16; 46 -2.54,-12.7; 47 -2.54,-15.24; 48 -2.54,-17.78; 49 -2.54,-20.32; 50 -2.54,-22.86; 51 -2.54,-25.4; 52 -2.54,-27.94; 53 -2.54,-30.48; 54 -2.54,-33.02; 55 -2.54,-35.56; 56 -2.54,-38.1; 57 -2.54,-40.64; 58 -2.54,-43.18; 59 -2.54,-45.72; 60 -2.54,-48.26; 61 78.74,-48.26; 62 78.74,-45.72; 63 78.74,-43.18; 64 78.74,-40.64; 65 78.74,-38.1; 66 78.74,-35.56; 67 78.74,-33.02; 68 78.74,-30.48; 69 78.74,-27.94; 70 78.74,-25.4; 71 78.74,-22.86; 72 78.74,-20.32; 73 78.74,-17.78; 74 78.74,-15.24; 75 78.74,-12.7; 76 78.74,-10.16; 77 78.74,-7.62; 78 78.74,-5.08; 79 78.74,-2.54; 80 78.74,0
0603 = smd 1 x 1.1: 1 -0.85,0; 2 0.85,0
SMC_A = smd 1.6 x 1.4: + -1.5,0; - 1.5,0
150CLZ-0810 = smd 3.5 x 2.5: + 3.25,0; - -3.25,0
J502-ND-142-0701-801/806 = smd 5.08 x 2.286: 1 2.565,0; G@1 2.565,4.42; G@2 2.565,-4.42 | smd 5.08 x 2.286 bottom: G@3 2.565,4.42; G@4 2.565,-4.42
USB-MICRO-B-H = smd 1.7 x 0.45: 4 2.8,-0.65; D+ 2.8,0; D- 2.8,0.65; GND 2.8,-1.3; VBUS 2.8,1.3 | smd 1.9 x 2.375: GND1 0,2.95; GND4 0,-2.95 | smd 2.1 x 1.475: GND2 2.3,2.5; GND3 2.3,-2.5
FC68148S = smd 3 x 2: 1-1 5.5,-5; 1-2 5.5,-11; 2 -5.5,-11; 3 -5.5,-5 | hole 2: 0,-5.1; 0,-9.5
SOD123 = smd 1.6 x 0.8: 1 -1.7,0; 2 1.7,0
TO263-5 = smd 1.067 x 2.159: 1 -3.404,-5.791; 2 -1.702,-5.791; 3 0,-5.791; 4 1.702,-5.791; 5 3.404,-5.791 | smd 10.8 x 10.41: 6 0,2.54
SC70-5 = smd 0.4 x 0.7: 1 -0.65,-0.85; 2 0,-0.85; 3 0.65,-0.85; 4 0.65,0.85; 5 -0.65,0.85
JAE_SF56S006V4BR2000 = smd 1.2 x 0.8: C1 2.66,-3.99; C2 0.47,-3.99; C3 -1.72,-3.99; C5 2.66,-2.89; C6 0.47,-2.89; C7 -1.72,-2.89 | smd 1 x 0.65: DSW2 1,7.775 | smd 1.2 x 1.4: HD1 -6.8,-7.4 | smd 1.2 x 2.35: HD2,DSW1 -6.4,6.475 | smd 1.75 x 1.3: HD3 2.87,7.45 | smd 1 x 1.1: HD4 6.9,-7.55
CHIPLED_0603 = smd 0.8 x 0.8: A 0,-0.75; C 0,0.75
LTE_MODULE_BG96 = smd 1.15 x 0.7: 1 -9.175,9.7; 2 -9.175,8.6; 3 -9.175,7.5; 4 -9.175,6.4; 5 -9.175,5.3; 6 -9.175,4.2; 7 -9.175,3.1; 8 -9.175,2; 9 -9.175,0.9; 10 -9.175,-0.2; 11 -9.175,-1.9; 12 -9.175,-3; 13 -9.175,-4.1; 14 -9.175,-5.2; 15 -9.175,-6.3; 16 -9.175,-7.4; 17 -9.175,-8.5; 18 -9.175,-9.6; 32 9.175,-9.6; 33 9.175,-8.5; 34 9.175,-7.4; 35 9.175,-6.3; 36 9.175,-5.2; 37 9.175,-4.1; 38 9.175,-3; 39 9.175,-1.9; 40 9.175,-0.2; 41 9.175,0.9; 42 9.175,2; 43 9.175,3.1; 44 9.175,4.2; 45 9.175,5.3; 46 9.175,6.4; 47 9.175,7.5; 48 9.175,8.6; 49 9.175,9.7 | smd 0.7 x 1.15: 19 -7.45,-11.025; 20 -6.35,-11.025; 21 -5.25,-11.025; 22 -4.15,-11.025; 23 -3.05,-11.025; 24 -1.95,-11.025; 25 0.55,-11.025; 26 1.65,-11.025; 27 2.75,-11.025; 28 3.85,-11.025; 29 4.95,-11.025; 30 6.05,-11.025; 31 7.15,-11.025; 50 7.15,11.025; 51 6.05,11.025; 52 4.95,11.025; 53 3.85,11.025; 54 2.75,11.025; 55 1.65,11.025; 56 0.55,11.025; 57 -1.95,11.025; 58 -3.05,11.025; 59 -4.15,11.025; 60 -5.25,11.025; 61 -6.35,11.025; 62 -7.45,11.025 | smd 1 x 1: 63 -5.95,4.25; 64 -5.95,2.55; 65 -5.95,0.85; 66 -5.95,-0.85; 67 -5.95,-2.55; 68 -5.95,-4.25; 69 -2.55,-7.65; 70 -0.85,-7.65; 71 0.85,-7.65; 72 2.55,-7.65; 73 5.95,-4.25; 74 5.95,-2.55; 75 5.95,-0.85; 76 5.95,0.85; 77 5.95,2.55; 78 5.95,4.25; 79 2.55,7.65; 80 0.85,7.65; 81 -0.85,7.65; 82 -2.55,7.65; 83 -4.25,4.25; 84 -4.25,2.55; 85 -4.25,0.85; 86 -4.25,-0.85; 87 -4.25,-2.55; 88 -4.25,-4.25; 89 -2.55,-5.95; 90 -0.85,-5.95; 91 0.85,-5.95; 92 2.55,-5.95; 93 4.25,-4.25; 94 4.25,-2.55; 95 4.25,-0.85; 96 4.25,0.85; 97 4.25,2.55; 98 4.25,4.25; 99 2.55,5.95; 100 0.85,5.95; 101 -0.85,5.95; 102 -2.55,5.95
SOT23-3 = smd 1 x 1.4: 1 -0.95,-1.1; 2 0.95,-1.1; 3 0,1.1
TP50-SMD = smd 1.27 x 1.27: TP 0,0
TSSOP-20 = smd 1.55 x 0.25: 1 0,0; 2 0,-0.65; 3 0,-1.3; 4 0,-1.95; 5 0,-2.6; 6 0,-3.25; 7 0,-3.9; 8 0,-4.55; 9 0,-5.2; 10 0,-5.85; 11 5.6,-5.85; 12 5.6,-5.2; 13 5.6,-4.55; 14 5.6,-3.9; 15 5.6,-3.25; 16 5.6,-2.6; 17 5.6,-1.95; 18 5.6,-1.3; 19 5.6,-0.65; 20 5.6,0
SOT23-6L = smd 0.55 x 1.2: 1 -0.95,-1.3; 2 0,-1.3; 3 0.95,-1.3; 4 0.95,1.3; 5 0,1.3; 6 -0.95,1.3
VQFN-8-1 = smd 0.4 x 0.8: 1 -1.905,-2.85; 2 -0.635,-2.85; 3 0.635,-2.85; 4 1.905,-2.85; 5 1.905,2.85; 6 0.635,2.85; 7 -0.635,2.85; 8 -1.905,2.85 | smd 4.2 x 3.4: P 0,0

### Placement (x,y rotation side)
BRD1  3.81,77.47 0 top
C1  49.02,7.49 0 top
C2  49.02,12.7 0 top
C3  39.88,16.89 180 top
C4  39.88,15.37 180 top
C5  39.88,13.84 180 top
C6  39.37,12.06 180 top
C7  28.57,40.77 180 top
C8  28.57,42.29 180 top
C9  28.57,43.81 180 top
C10  27.94,45.72 180 top
C11  58.55,72.14 90 top
C12  51.31,50.42 180 top
C13  52.7,71.25 270 top
C14  52.07,56.64 270 top
C15  28.57,7.62 0 top
C16  28.57,12.7 0 top
C17  64.64,40.26 180 top
C18  24,24.51 180 top
C19  13.46,71.5 90 top
C20  24.13,71.63 90 top
C21  24,28.7 180 top
C22  64.64,45.85 180 top
C23  24,25.91 180 top
C24  13.59,23.75 0 top
CON1  49.91,0 90 top
CON2  39.12,77.34 270 top
CON3  67.91,78.73 0 top
CON4  29.34,0 90 top
D1  27.69,47.88 0 top
IC1  67.18,55.12 270 top
IC2  10.41,26.42 180 top
J1  8.89,8.38 0 top
LED1  9.14,42.29 0 top
LED2  11.56,42.29 0 top
LED4  13.72,42.29 180 top
MOD1  44.7,31.24 180 top
R1  49.91,10.16 90 top
R2  51.31,47.62 180 top
R3  51.31,49.02 180 top
R4  59.05,52.58 90 top
R5  59.05,49.53 90 top
R6  57.53,52.58 90 top
R7  68.58,43.18 270 top
R8  67.18,43.18 270 top
R9  68.45,37.72 270 top
R10  67.06,37.72 270 top
R11  9.14,54.48 0 top
R12  9.14,52.83 0 top
R13  9.14,45.97 270 top
R14  29.34,10.16 90 top
R15  11.56,45.97 270 top
R19  28.7,27.3 180 top
R20  28.7,24.51 180 top
R21  28.7,25.91 180 top
R22  24,27.3 180 top
R23  11.94,28.83 0 top
R24  13.72,45.97 90 top
T1  64.39,43.18 90 top
T2  64.39,37.72 90 top
T3  9.14,49.78 180 top
TP1  58.04,40.89 0 top
TP2  54.74,45.85 0 top
TP3  46.61,45.85 0 top
TP4  58.17,22.61 0 top
TP10  40.77,45.85 0 top
TP11  42.55,45.85 0 top
TP12  44.2,45.85 0 top
TP13  30.23,31.5 0 top
TP14  28.32,31.5 0 top
TP15  38.61,45.85 0 top
TP16  28.32,35.31 0 top
TP17  28.32,33.15 0 top
TP18  30.23,34.16 0 top
TP19  30.23,36.45 0 top
TP20  59.94,27.05 90 top
TP21  58.17,28.19 0 top
TP22  59.94,24.89 0 top
TP24  58.17,25.91 0 top
TP25  59.94,21.46 0 top
TP27  2.16,21.72 0 top
TP28  2.03,17.53 0 top
TP29  8.13,26.42 0 top
TP31  14.1,17.53 0 top
U1  16,71.25 0 top
U2  39.37,70.48 270 top
U4  8.26,21.84 270 top

### Tracks (layer width: path | path; a pad name or v marks a point on that pad's centre or on a via)
+1.8V  (via drill 0.25)
  Top 0.152: 13.52,70.6 C19.1 | 13.52,70.6 11.7,70.6 v11.05,71.25 | U1.2 13.52,70.6 | MOD1.29 v39.75,44.95 v39.75,44.96 | U1.10 11.06,65.4 v11.05,65.41 11.05,64.39 22.1,53.34 v22.1,51.69
  Bottom 0.152: v39.75,44.96 36.45,44.96 34.04,47.37 30.23,51.18 26.92,51.18 22.61,51.18 v22.1,51.69 | v11.05,71.25 v11.05,65.41
+3.3V  (via drill 0.25)
  Top 0.152: C20.1 23.95,70.6 | 23.95,70.6 25.51,70.6 v26.16,71.25 | 23.95,70.6 U1.19 | R24.2 14.95,46.82 v15.37,47.24
  Top 0.406: BRD1.2 BRD1.42
  pour Bottom: 18.03,0 18.03,25.15 61.21,25.15 61.21,0 83.82,0 83.82,78.74 0,78.74 0,0
+V_BB
  Top 0.152: C7.1 29.43,39.97 29.34,39.88 28.96,39.5 25.15,39.5 24.26,40.39 16.51,40.39 11.56,40.39 | 11.56,40.39 9.65,40.39 9.14,40.89 LED1.A | LED2.A 11.56,40.39
  Top 0.711: MOD1.33 33.54,39.74 32.51,40.77 arc-90 32.59,40.84 MOD1.32
  Top 0.813: 31.37,47.88 D1.2 29.39,45.77 C10.+ 29.44,43.83 C9.1 C8.1 C7.1
  Top 1.016: R3.2 49.28,49.02 48.51,49.78 33.27,49.78 31.37,47.88 | 32.51,40.77 C7.1
+V_RF  (via drill 0.6)
  Top 0.726: MOD1.53 40.85,18.8 | 40.85,18.8 40.85,17.02 C3.1 C4.1 C5.1 40.73,12.21 C6.+ | MOD1.52 39.75,18.92 39.88,18.8 40.85,18.8
  Top 1.016: R2.2 49.28,47.62 48.39,47.62 47.75,48.26 34.42,48.26 v31.88,45.72 v31.88,44.32 v31.88,42.93 | v40.89,7.87 40.87,8.91 C6.+
  Bottom 1.016: v40.89,10.67 v40.89,9.27 v40.89,7.87 40.89,24.51 31.88,33.53 v31.88,42.93 v31.88,44.32 v31.88,45.72
DBG_RXD_1V8  (via drill 0.25)
  Top 0.152: U1.5 17.08,68.65 17.4,68.33 v17.4,63.25 16.89,62.74 16.89,60.07 18.67,58.29 v40.77,58.29 | 48.9,42.27 MOD1.22 48.77,42.27 v48.77,45.85
  Bottom 0.152: v48.77,45.85 48.77,47.5 47.5,48.77 44.45,48.77 40.13,53.09 40.13,57.02 40.13,57.66 v40.77,58.29
DBG_RXD_3V3  (via drill 0.6)
  Top 0.152: v34.42,65.02 30.79,68.65 U1.16
  Bottom 0.152: BRD1.71 81.28,55.88 77.34,55.88 76.71,56.52 76.71,63.75 74.93,65.53 66.8,65.53 37.21,65.53 36.7,65.02 35.69,65.02 v34.42,65.02
DBG_TXD_1V8  (via drill 0.25)
  Top 0.152: U1.4 17.19,69.3 17.78,68.71 18.03,68.45 18.03,62.74 18.03,62.61 17.65,62.23 17.65,60.33 18.8,59.18 v39.5,59.18 | MOD1.23 47.75,43.81 v47.75,44.96
  Bottom 0.152: v47.75,44.96 47.75,47.62 47.24,48.13 44.2,48.13 39.5,52.83 v39.5,59.18
DBG_TXD_3V3  (via drill 0.6)
  Top 0.152: U1.17 33.06,69.3 v36.2,66.17
  Bottom 0.152: v36.2,66.17 73.53,66.17 75.06,66.17 77.34,63.88 77.34,59.05 77.98,58.42 81.28,58.42 BRD1.72
GND  (via drill 0.25)
  other vias: 30.86,6.1 30.86,7.49 30.86,8.89 30.86,10.29 30.86,11.68 30.86,13.08 30.86,14.48 30.86,15.88 30.86,17.27 30.99,18.67 31.88,19.68 33.27,20.19 34.67,20.19 28.07,15.88 28.07,14.48 26.67,14.48 26.04,13.21 26.04,11.81 27.18,10.79 27.18,9.27 26.04,8.26 26.04,6.86 27.18,5.97 28.07,17.27 28.19,18.67 28.7,20.07 29.59,21.21 30.61,22.23 31.88,22.86 33.27,22.86 51.44,5.97 51.44,7.37 51.44,8.76 51.44,10.16 51.44,11.56 51.44,12.95 51.44,14.35 51.44,15.75 51.44,17.14 51.44,18.54 48.51,14.35 48.51,15.75 48.51,17.14 48.51,18.54 47.12,14.35 46.48,13.08 47.5,5.84 46.48,11.68 47.62,10.79 47.62,9.4 46.48,8.51 46.48,6.99
  pour Top: 0,0 83.82,0 83.82,78.74 0,78.74
  pour Bottom: 18.67,0 60.58,0 60.58,24.51 18.67,24.51
MCU_RX_1V8  (via drill 0.25)
  Top 0.152: U1.3 17.94,69.95 18.67,69.22 v18.67,61.85 | MOD1.35 31.04,37.54 19.86,37.54 19.73,37.54 v18.03,39.24
  Bottom 0.152: v18.67,61.85 18.67,39.88 v18.03,39.24
MCU_RX_3V3  (via drill 0.25)
  Top 0.152: U1.18 20.67,69.95 20.07,69.34 v20.07,68.33
  Bottom 0.152: v20.07,68.33 15.75,68.33 14.35,66.93 14.35,59.44 9.53,54.61 BRD1.10
MCU_TX_1V8  (via drill 0.25)
  Top 0.152: U1.1 18.29,71.25 19.3,70.23 19.3,62.74 v20.19,61.85 | MOD1.34 20.67,38.64 v20.19,39.12
  Bottom 0.152: v20.19,39.12 19.3,40.01 19.3,60.96 v20.19,61.85
MCU_TX_3V3  (via drill 0.25)
  Top 0.152: U1.20 v20.07,71.25
  Bottom 0.152: v20.07,71.25 16.26,71.25 13.72,68.71 13.72,59.69 11.18,57.15 BRD1.9
N$1
  Top 0.305: R24.1 LED4.A
N$2
  Top 0.406: BRD1.79 BRD1.39
N$3
  Top 0.406: BRD1.78 BRD1.38
N$4
  Top 0.305: R15.2 LED2.C
N$5
  Top 0.406: BRD1.76 BRD1.36
N$6
  Top 0.406: BRD1.75 BRD1.35
N$7
  Top 0.406: BRD1.74 BRD1.34
N$8
  Top 0.305: R13.2 LED1.C
N$9
  Top 0.152: MOD1.30 38.65,45.8 TP15.TP
N$10
  Top 0.152: MOD1.37 28.36,35.34
  Top 0.305: 28.36,35.34 TP16.TP
N$11
  Top 0.406: BRD1.70 BRD1.30
N$12
  Top 0.406: BRD1.69 BRD1.29
N$13
  Top 0.406: BRD1.68 BRD1.28
N$14
  Top 0.406: BRD1.67 BRD1.27
N$15
  Top 0.406: BRD1.66 BRD1.26
N$16
  Top 0.406: BRD1.65 BRD1.25
N$17
  Top 0.406: BRD1.64 BRD1.24
N$18
  Top 0.406: BRD1.63 BRD1.23
N$19
  Top 0.406: BRD1.62 BRD1.22
N$20
  Top 0.406: BRD1.61 BRD1.21
N$21
  Top 0.152: MOD1.39 TP17.TP
  Top 0.305: TP17.TP
N$22
  Top 0.152: MOD1.38 30.43,34.24 TP18.TP
N$23
  Top 0.406: BRD1.3 BRD1.43
N$24
  Top 0.406: BRD1.4 BRD1.44
N$25
  Top 0.406: BRD1.5 BRD1.45
N$26
  Top 0.406: BRD1.6 BRD1.46
N$27
  Top 0.406: BRD1.7 BRD1.47
N$28
  Top 0.406: BRD1.8 BRD1.48
N$29
  Top 0.726: CON1.1 49.91,7.45 C1.2 49.91,7.53 R1.1
N$30
  Top 0.726: MOD1.60 49.95,12.78 C2.2 49.87,11.05 R1.2
N$31
  Top 0.406: BRD1.11 BRD1.51
N$32
  Top 0.406: BRD1.12 BRD1.52
N$33
  Top 0.406: BRD1.13 BRD1.53
N$34
  Top 0.406: BRD1.14 BRD1.54
N$35
  Top 0.406: BRD1.15 BRD1.55
N$36
  Top 0.406: BRD1.16 BRD1.56
N$37
  Top 0.406: BRD1.17 BRD1.57
N$38
  Top 0.406: BRD1.18 BRD1.58
N$39
  Top 0.406: BRD1.19 BRD1.59
N$40
  Top 0.406: BRD1.20 BRD1.60
N$41
  Top 1.016: C13.+ 57.15,68 58.55,69.39 C11.1 73.32,71.29 73.41,71.37 | IC1.1 58.32,58.52 58.29,58.55 | IC1.2 58.37,56.82 58.29,56.9
  Top 1.676: CON3.1-1 73.41,71.37 CON3.1-2
  Top 2.54: C13.+ 52.7,63.63 56.9,63.63 58.29,62.23 58.29,58.55 58.29,56.9 58.29,56.77
N$42
  Top 1.016: R5.2 R4.1 61.38,51.73 IC1.5
N$43
  Top 0.726: CON4.1 29.34,7.53 C15.2 29.43,9.22 R14.1
N$45
  Top 0.726: R14.2 29.34,12.61 C16.2 29.46,12.74 29.46,17.65 arc-90 33.35,21.54 MOD1.49
N$46
  Top 0.152: T2.1 65.59,36.87 R10.2 R9.2
N$47
  Top 0.152: U4.7 10.41,22.48 10.29,22.61 10.29,24.64 9.76,25.16 IC2.4 8.98,25.57 TP29.TP
N$48
  Top 0.152: MOD1.36 TP19.TP
  Top 0.305: TP19.TP
N$49
  Top 0.152: T1.1 65.59,42.33 R8.2 R7.2
N$50
  Top 0.152: MOD1.6 TP20.TP
N$51
  Top 0.152: CON2.D+ 39.12,71.63 38.99,71.5 38.92,71.44 U2.1
N$52
  Top 0.152: MOD1.7 58.11,28.14 TP21.TP
N$53
  Top 0.152: MOD1.4 59.89,24.84 TP22.TP
N$54
  Top 0.152: CON2.D- 39.77,70.25 39.12,69.6 39.05,69.53 U2.3
N$56  (via drill 0.25)
  Top 0.152: U2.6 44.13,71.44 44.83,70.74 44.83,68.96 44.83,53.72 v45.47,53.09 | MOD1.9 v62.6,30.34 v62.61,30.35
  Bottom 0.152: v45.47,53.09 57.02,53.09 60.96,49.15 60.96,32 v62.61,30.35
N$57  (via drill 0.25)
  Top 0.152: U2.4 42.73,69.53 43.31,68.96 43.31,53.72 v42.67,53.09 | MOD1.10 53.93,31.5 v58.8,31.5
  Bottom 0.152: v42.67,53.09 44.58,51.18 45.59,51.18 56.39,51.18 59.18,48.39 59.18,31.88 v58.8,31.5
N$58
  Top 0.305: T3.1 9.99,50.88 R12.2 R11.2
N$59
  Top 0.152: MOD1.5 58.13,25.94 TP24.TP
N$60  (via drill 0.25)
  Top 0.152: IC2.2 10.41,28.07 v9.27,29.21 | v15.75,28.57 v15.75,21.46 | v8.26,4.45 8.31,4.39 J1.C2
  Top 0.305: R19.2 27.73,27.18 v26.42,27.18 26.42,28.19 25.91,28.7 C21.1
  Bottom 0.152: v9.27,29.21 9.91,28.57 v15.75,28.57 16.76,28.57 25.02,28.57 v26.42,27.18 | v8.26,4.45 14.1,4.45 15.75,6.1 v15.75,21.46
N$61
  Top 0.152: MOD1.1 59.87,21.54 TP25.TP
N$63
  Top 0.152: MOD1.41 31.76,30.34 31.74,30.34 31.5,30.1 29.72,30.1 TP14.TP
N$64
  Top 0.152: MOD1.40 30.28,31.44
  Top 0.305: 30.28,31.44 TP13.TP
N$65
  Top 0.152: TP12.TP 43.05,44.7 MOD1.26
N$66  (via drill 0.25)
  Top 0.152: U4.6 v12.7,21.21 12.7,19.56 11.94,18.8 5.59,18.8 4.7,17.91 4.7,16.76 | 4.7,16.76 4.7,11.68 4.7,4.95 5.26,4.39 J1.C3 | TP28.TP 2.79,16.76 4.7,16.76
  Top 0.305: R20.2 v26.42,24.51 C18.1
  Bottom 0.152: v26.42,24.51 25.65,25.27 16.76,25.27 v12.7,21.21
N$67  (via drill 0.25)
  Top 0.152: J1.C7 7.11,5.55 6.01,5.55 5.33,6.22 5.33,12.32 5.33,16.64 5.33,16.89 v5.97,17.53 6.6,18.16 6.99,18.16 12.95,18.16 13.59,18.8 13.59,25.27 v14.22,25.91 | U4.2 4.32,22.48 3.56,21.72 | 3.56,21.72 v3.56,17.53 | 3.56,21.72 TP27.TP
  Top 0.305: R21.2 v26.42,25.91 C23.1 R22.1
  Bottom 0.152: v26.42,25.91 18.16,25.91 v14.22,25.91 | v3.56,17.53 5.71,17.53 v5.97,17.53
N$68
  Top 0.152: MOD1.27 41.95,45.26 TP11.TP
N$69
  Top 0.152: MOD1.28 40.85,45.76 TP10.TP
N$70
  Top 0.152: MOD1.18 53.93,40.89 TP1.TP
N$71
  Top 1.016: IC1.4 59.07,53.42 R4.2 R6.2 52.11,53.43 C14.+ 52.16,53.3 C12.1 R3.1 R2.1
N$72
  Top 0.152: MOD1.19 53.06,42.27 54.74,43.94 TP2.TP
N$74
  Top 0.152: MOD1.2 58.13,22.64 TP4.TP
N$75
  Top 0.152: MOD1.24 46.65,45.8 TP3.TP
N$89  (via drill 0.25)
  Top 0.152: J1.C6 9.33,5.46 v8.26,5.46 | v14.61,19.05 14.1,18.54 TP31.TP
  Bottom 0.152: v8.26,5.46 13.21,5.46 14.1,6.35 14.1,18.54 v14.61,19.05
NETLIGHT  (via drill 0.25)
  Top 0.152: MOD1.21 49.91,42.31 v49.91,45.85 | v22.1,50.55 17.4,50.55 | 17.4,50.55 16.89,50.55 | 8.26,54.52 R11.1 8.29,55.28 8.64,55.63 10.79,55.63 11.18,55.24 11.18,50.93 11.56,50.55 17.4,50.55
  Bottom 0.152: v49.91,45.85 49.91,44.58 49.02,43.69 36.7,43.69 29.84,50.55 v22.1,50.55
NRST
  Top 0.152: C22.2 63.79,44.87 63.37,44.45 63.29,44.37 T1.3 63.16,43.05 59.94,43.05 59.31,42.42 59.31,40.26 58.79,39.74 MOD1.17
NRST1
  Top 0.305: T3.3 R13.1
NRST_CTL
  Top 0.152: R7.1 74.76,44.03 75.56,44.83 75.69,44.83 76.33,45.47 76.33,58.29 77.72,59.69 BRD1.33
PWRKEY
  Top 0.152: C17.2 63.79,39.28 63.37,38.86 63.29,38.78 T2.3 62.1,37.72 61.93,37.54 MOD1.15
PWRKEY_CTL  (via drill 0.6)
  Top 0.152: BRD1.37 77.85,69.85 76.96,68.96 76.96,65.41 v75.06,63.5 | v73.91,38.61 68.49,38.61 R9.1
  Bottom 0.152: v75.06,63.5 75.06,39.75 v73.91,38.61
SIM_VDD  (via drill 0.25)
  Top 0.152: MOD1.43 30.79,28.14 30.35,28.57 27.18,28.57 25.91,29.84 v21.21,29.84 21.21,27.81 21.72,27.3 R22.2 | 11.11,25.52 IC2.5 | 11.11,25.53 11.11,25.52 | v17.02,29.84 17.02,18.29 17.02,15.49 17.02,14.61 16.26,13.84 16.26,5.21 15.44,4.39 J1.C1 | 12.79,25.52 11.11,25.52 | 12.79,25.52 12.79,25.53 R23.2 12.83,28.87 14.01,28.87 14.48,29.34 v14.48,29.84 | U4.8 C24.1 12.79,23.8 12.79,25.52
  Bottom 0.152: v14.48,29.84 v17.02,29.84 v21.21,29.84
STATUS  (via drill 0.25)
  Top 0.152: v51.05,45.85 MOD1.20 | v22.1,49.15 16.26,49.15 12.32,49.15 11.56,48.39 R15.1
  Bottom 0.152: v51.05,45.85 51.05,44.58 49.53,43.05 45.59,43.05 36.45,43.05 29.59,49.91 27.05,49.91 22.86,49.91 v22.1,49.15
USIM_CLK
  Top 0.305: MOD1.46 32.46,24.84 32.13,24.51 R20.1
USIM_DATA
  Top 0.305: MOD1.45 29.59,25.94 R21.1
USIM_PRESENCE  (via drill 0.25)
  Top 0.152: MOD1.42 27.53,29.24 v25.53,31.24 | v12.06,31.24 11.09,30.27 R23.1 11.06,28.8 IC2.1 11.1,27.3 v11.81,27.3 | J1.DSW2 9.89,16.88 v10.29,17.27
  Bottom 0.152: v10.29,17.27 11.81,18.8 v11.81,27.3 | v25.53,31.24 v12.06,31.24
USIM_RST
  Top 0.305: MOD1.44 29.82,27.04 R19.1
VBUS  (via drill 0.25)
  Top 0.152: v42.16,70.48 43.18,70.48 44.07,69.6 44.07,53.47 v45.47,52.07 | v61.59,29.21 53.91,29.21 MOD1.8
  Top 0.406: CON2.VBUS 40.42,73 40.77,72.64 42.16,72.64 v42.55,72.26 | v42.16,70.48 U2.5
  Bottom 0.152: v45.47,52.07 56.64,52.07 60.07,48.64 60.07,30.73 v61.59,29.21
  Bottom 0.406: v42.55,72.26 42.55,70.87 v42.16,70.48

### Text on the board
tPlace: 5v@2A | + | GNSS | GSM
TopSilkscreen: NET | PWR | STATUS | Quectel BG96 / v1.1.0